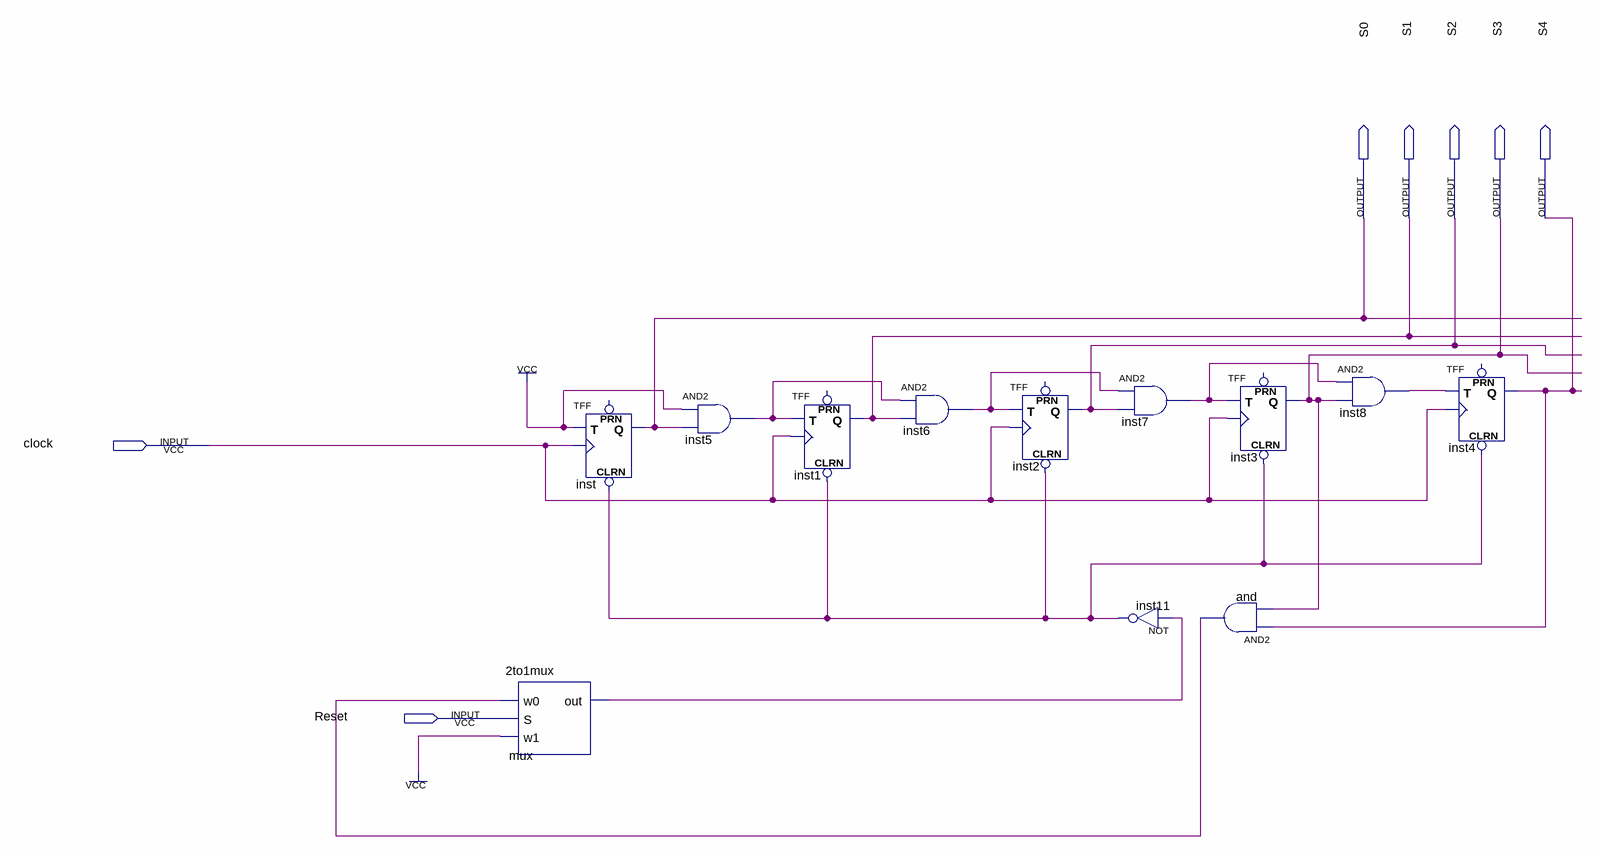
[diagram p0: schematic sheet]
// Quartus schematic clocknobounce.bdf as structural Verilog: 12 symbols, 7 pins
module clocknobounce (
  input  clock,
  input  Reset,
  output S0,
  output S1,
  output S2,
  output S3,
  output S4
);

  wire and_out, inst5_out, inst6_out, inst7_out, inst8_out, inst11_out, mux_out;

  \2to1mux  mux (.w0(and_out), .S(Reset), .w1(1'b1), .out(mux_out));
  TFF inst (.CLRN(inst11_out), .T(1'b1), .CLK(clock), .Q(S0));  // open: PRN
  and inst5 (inst5_out, 1'b1, S0);
  TFF inst1 (.CLRN(inst11_out), .T(inst5_out), .CLK(clock), .Q(S1));  // open: PRN
  and inst6 (inst6_out, inst5_out, S1);
  TFF inst2 (.CLRN(inst11_out), .T(inst6_out), .CLK(clock), .Q(S2));  // open: PRN
  and inst7 (inst7_out, inst6_out, S2);
  not inst11 (inst11_out, mux_out);
  TFF inst3 (.CLRN(inst11_out), .T(inst7_out), .CLK(clock), .Q(S3));  // open: PRN
  and \and  (and_out, S4, S3);
  and inst8 (inst8_out, inst7_out, S3);
  TFF inst4 (.CLRN(inst11_out), .T(inst8_out), .CLK(clock), .Q(S4));  // open: PRN
endmodule
